# Vivado block design design_1, xczu28dr-ffvg1517-2-e, Vivado 2019.1
# (continued, part 3 of 5)
current_bd_instance /tx_channelizer
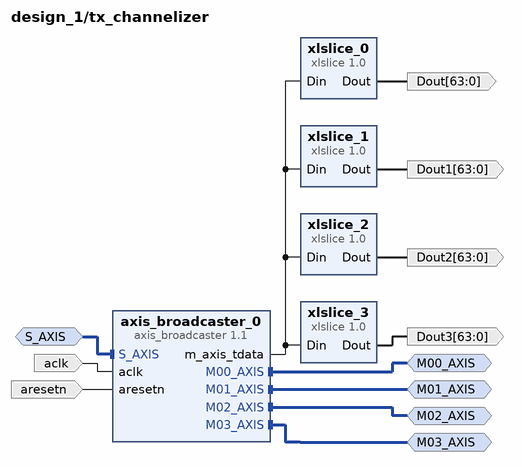
[diagram p43: block diagram inside /tx_channelizer]
create_bd_intf_pin -mode Slave -vlnv xilinx.com:interface:axis_rtl:1.0 S_AXIS
create_bd_intf_pin -mode Master -vlnv xilinx.com:interface:axis_rtl:1.0 M00_AXIS
create_bd_intf_pin -mode Master -vlnv xilinx.com:interface:axis_rtl:1.0 M01_AXIS
create_bd_intf_pin -mode Master -vlnv xilinx.com:interface:axis_rtl:1.0 M02_AXIS
create_bd_intf_pin -mode Master -vlnv xilinx.com:interface:axis_rtl:1.0 M03_AXIS
create_bd_pin -dir O -from 63 -to 0 Dout
create_bd_pin -dir O -from 63 -to 0 Dout1
create_bd_pin -dir O -from 63 -to 0 Dout2
create_bd_pin -dir O -from 63 -to 0 Dout3
create_bd_pin -dir I -type clk aclk
create_bd_pin -dir I -type rst aresetn

create_bd_cell -type ip -vlnv xilinx.com:ip:xlslice:1.0 xlslice_0
set_property -dict {CONFIG.DIN_FROM 255 CONFIG.DIN_TO 192 CONFIG.DIN_WIDTH 256 CONFIG.DOUT_WIDTH 1} [get_bd_cells xlslice_0]
create_bd_cell -type ip -vlnv xilinx.com:ip:xlslice:1.0 xlslice_1
set_property -dict {CONFIG.DIN_FROM 191 CONFIG.DIN_TO 128 CONFIG.DIN_WIDTH 256 CONFIG.DOUT_WIDTH 64} [get_bd_cells xlslice_1]
create_bd_cell -type ip -vlnv xilinx.com:ip:xlslice:1.0 xlslice_2
set_property -dict {CONFIG.DIN_FROM 63 CONFIG.DIN_TO 0 CONFIG.DIN_WIDTH 256 CONFIG.DOUT_WIDTH 1} [get_bd_cells xlslice_2]
create_bd_cell -type ip -vlnv xilinx.com:ip:xlslice:1.0 xlslice_3
set_property -dict {CONFIG.DIN_FROM 127 CONFIG.DIN_TO 64 CONFIG.DIN_WIDTH 256 CONFIG.DOUT_WIDTH 64} [get_bd_cells xlslice_3]
create_bd_cell -type ip -vlnv xilinx.com:ip:axis_broadcaster:1.1 axis_broadcaster_0
set_property -dict [list \
  CONFIG.HAS_TKEEP 1 \
  CONFIG.M02_TDATA_REMAP {tdata[255:0]} \
  CONFIG.M03_TDATA_REMAP {tdata[255:0]} \
  CONFIG.NUM_MI 4 \
] [get_bd_cells axis_broadcaster_0]

# ---- hierarchy /channel_mux ----
current_bd_instance /channel_mux
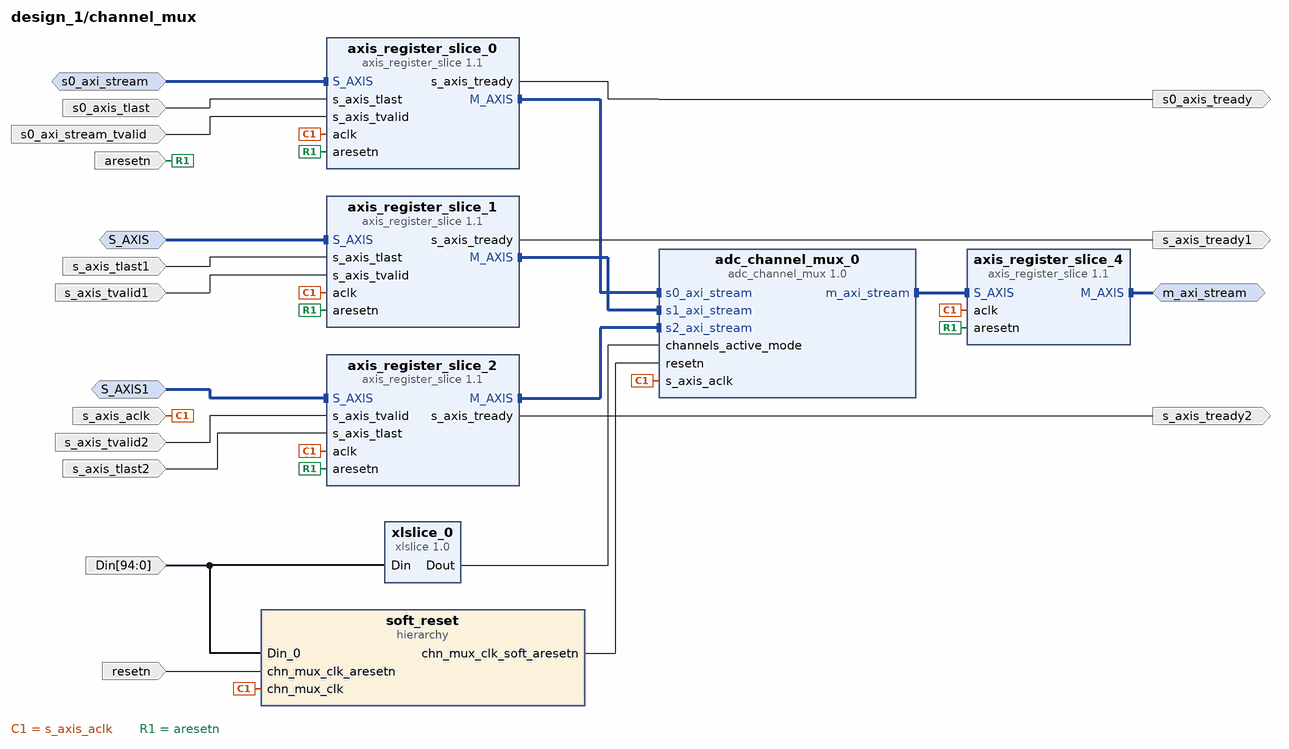
[diagram p44: block diagram inside /channel_mux]
create_bd_intf_pin -mode Master -vlnv xilinx.com:interface:axis_rtl:1.0 m_axi_stream
create_bd_intf_pin -mode Slave -vlnv xilinx.com:interface:axis_rtl:1.0 s0_axi_stream
create_bd_intf_pin -mode Slave -vlnv xilinx.com:interface:axis_rtl:1.0 S_AXIS
create_bd_intf_pin -mode Slave -vlnv xilinx.com:interface:axis_rtl:1.0 S_AXIS1
create_bd_pin -dir I -type clk s_axis_aclk
create_bd_pin -dir I -type rst resetn
create_bd_pin -dir I -from 94 -to 0 Din
create_bd_pin -dir O s0_axis_tready
create_bd_pin -dir I -type rst aresetn
create_bd_pin -dir I s0_axis_tlast
create_bd_pin -dir I s0_axi_stream_tvalid
create_bd_pin -dir I s_axis_tlast1
create_bd_pin -dir I s_axis_tvalid1
create_bd_pin -dir O s_axis_tready1
create_bd_pin -dir I s_axis_tvalid2
create_bd_pin -dir O s_axis_tready2
create_bd_pin -dir I s_axis_tlast2

create_bd_cell -type ip -vlnv user.org:user:adc_channel_mux:1.0 adc_channel_mux_0
set_property -dict {CONFIG.AXIS_TDATA_WIDTH 512} [get_bd_cells adc_channel_mux_0]
create_bd_cell -type ip -vlnv xilinx.com:ip:xlslice:1.0 xlslice_0
set_property -dict {CONFIG.DIN_FROM 73 CONFIG.DIN_TO 42 CONFIG.DIN_WIDTH 95 CONFIG.DOUT_WIDTH 32} [get_bd_cells xlslice_0]
create_bd_cell -type hier soft_reset
create_bd_cell -type ip -vlnv xilinx.com:ip:axis_register_slice:1.1 axis_register_slice_4
create_bd_cell -type ip -vlnv xilinx.com:ip:axis_register_slice:1.1 axis_register_slice_2
create_bd_cell -type ip -vlnv xilinx.com:ip:axis_register_slice:1.1 axis_register_slice_0
create_bd_cell -type ip -vlnv xilinx.com:ip:axis_register_slice:1.1 axis_register_slice_1

# ---- hierarchy /channel_mux/soft_reset ----
current_bd_instance /channel_mux/soft_reset
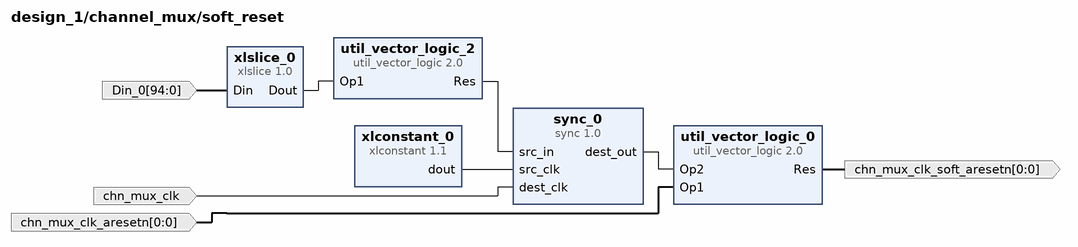
[diagram p45: block diagram inside /channel_mux/soft_reset]
create_bd_pin -dir I -from 94 -to 0 Din_0
create_bd_pin -dir I -type clk chn_mux_clk
create_bd_pin -dir O -from 0 -to 0 chn_mux_clk_soft_aresetn
create_bd_pin -dir I -from 0 -to 0 chn_mux_clk_aresetn

create_bd_cell -type ip -vlnv xilinx.com:ip:xlslice:1.0 xlslice_0
set_property -dict {CONFIG.DIN_FROM 74 CONFIG.DIN_TO 74 CONFIG.DIN_WIDTH 95 CONFIG.DOUT_WIDTH 1} [get_bd_cells xlslice_0]
create_bd_cell -type ip -vlnv xilinx.com:user:sync:1.0 sync_0
set_property -dict {CONFIG.SRC_INPUT_REG 0} [get_bd_cells sync_0]
create_bd_cell -type ip -vlnv xilinx.com:ip:xlconstant:1.1 xlconstant_0
set_property -dict {CONFIG.CONST_VAL 0} [get_bd_cells xlconstant_0]
create_bd_cell -type ip -vlnv xilinx.com:ip:util_vector_logic:2.0 util_vector_logic_2
set_property -dict {CONFIG.C_OPERATION not CONFIG.C_SIZE 1} [get_bd_cells util_vector_logic_2]
create_bd_cell -type ip -vlnv xilinx.com:ip:util_vector_logic:2.0 util_vector_logic_0
set_property -dict {CONFIG.C_SIZE 1} [get_bd_cells util_vector_logic_0]

# ---- connections ----

current_bd_instance /MTS_Block
connect_bd_intf_net [get_bd_intf_pins CLK_DIFF_PL_CLK] [get_bd_intf_pins util_ds_buf_0/CLK_IN_D]
connect_bd_intf_net [get_bd_intf_pins CLK_DIFF_SYSREF_CLK] [get_bd_intf_pins util_ds_buf_1/CLK_IN_D]
connect_bd_net [get_bd_pins util_ds_buf_0/IBUF_OUT] [get_bd_pins clk_wiz_0/clk_in1] [get_bd_pins sync_0/dest_clk]
connect_bd_net [get_bd_pins sync_0/dest_out] [get_bd_pins sync_1/src_in] [get_bd_pins sync_2/src_in]
connect_bd_net [get_bd_pins sync_1/dest_out] [get_bd_pins user_sysref_dac]
connect_bd_net [get_bd_pins xlconstant_0/dout] [get_bd_pins sync_0/src_clk] [get_bd_pins sync_1/src_clk] [get_bd_pins sync_2/src_clk]
connect_bd_net [get_bd_pins util_ds_buf_1/IBUF_OUT] [get_bd_pins sync_0/src_in]
connect_bd_net [get_bd_pins sync_2/dest_out] [get_bd_pins user_sysref_adc]
connect_bd_net [get_bd_pins clk_wiz_0/clk_out3] [get_bd_pins adc45_clk] [get_bd_pins sync_2/dest_clk]
connect_bd_net [get_bd_pins clk_wiz_0/clk_out1] [get_bd_pins dac45_clk] [get_bd_pins sync_1/dest_clk]
connect_bd_net [get_bd_pins clk_wiz_0/clk_out2] [get_bd_pins dac_clk]
connect_bd_net [get_bd_pins clk_wiz_0/clk_out4] [get_bd_pins adc_clk]

current_bd_instance /reset_block
connect_bd_net -net zynq_ultra_ps_e_0_pl_clk0 [get_bd_pins slowest_sync_clk] [get_bd_pins rst_ps8_0_96M/slowest_sync_clk]
connect_bd_net -net zynq_ultra_ps_e_0_pl_resetn0 [get_bd_pins ext_reset_in] \
  [get_bd_pins rst_ps8_0_96M1/ext_reset_in] [get_bd_pins rst_ps8_0_96M/ext_reset_in] \
  [get_bd_pins rst_ps8_0_96M2/ext_reset_in]
connect_bd_net [get_bd_pins rst_ps8_0_96M/peripheral_aresetn] [get_bd_pins peripheral_aresetn]
connect_bd_net -net MTS_Block_dac_clk [get_bd_pins slowest_sync_clk1] [get_bd_pins rst_ps8_0_96M1/slowest_sync_clk]
connect_bd_net [get_bd_pins rst_ps8_0_96M1/peripheral_aresetn] [get_bd_pins peripheral_aresetn1]
connect_bd_net [get_bd_pins rst_ddr4_0_333M/peripheral_aresetn] [get_bd_pins peripheral_aresetn2]
connect_bd_net -net slowest_sync_clk2_1 [get_bd_pins slowest_sync_clk2] [get_bd_pins rst_ddr4_0_333M/slowest_sync_clk]
connect_bd_net -net ext_reset_in1_1 [get_bd_pins ext_reset_in1] [get_bd_pins rst_ddr4_0_333M/ext_reset_in]
connect_bd_net [get_bd_pins rst_ps8_0_96M2/peripheral_aresetn] [get_bd_pins peripheral_aresetn3]
connect_bd_net -net slowest_sync_clk3_1 [get_bd_pins slowest_sync_clk3] [get_bd_pins rst_ps8_0_96M2/slowest_sync_clk]

current_bd_instance /dac_dma_block
connect_bd_intf_net [get_bd_intf_pins M00_AXIS] [get_bd_intf_pins axis_broadcaster_0/M00_AXIS]
connect_bd_intf_net [get_bd_intf_pins M01_AXIS] [get_bd_intf_pins axis_broadcaster_0/M01_AXIS]
connect_bd_intf_net [get_bd_intf_pins axi_register_slice_0/S_AXI] [get_bd_intf_pins axi_dma_0/M_AXI_MM2S]
connect_bd_intf_net [get_bd_intf_pins M04_AXIS] [get_bd_intf_pins axis_broadcaster_0/M04_AXIS]
connect_bd_intf_net [get_bd_intf_pins axis_register_slice_0/S_AXIS] [get_bd_intf_pins axi_dma_0/M_AXIS_MM2S]
connect_bd_intf_net [get_bd_intf_pins S_AXI_LITE] [get_bd_intf_pins axi_dma_0/S_AXI_LITE]
connect_bd_intf_net [get_bd_intf_pins M_AXI_MM2S] [get_bd_intf_pins axi_register_slice_0/M_AXI]
connect_bd_intf_net [get_bd_intf_pins M03_AXIS] [get_bd_intf_pins axis_broadcaster_0/M03_AXIS]
connect_bd_intf_net [get_bd_intf_pins axis_register_slice_0/M_AXIS] [get_bd_intf_pins axis_broadcaster_0/S_AXIS]
connect_bd_intf_net [get_bd_intf_pins M02_AXIS] [get_bd_intf_pins axis_broadcaster_0/M02_AXIS]
connect_bd_net -net zynq_ultra_ps_e_0_pl_clk0 [get_bd_pins s_axi_lite_aclk] [get_bd_pins axi_dma_0/s_axi_lite_aclk]
connect_bd_net -net rst_ps8_0_96M_peripheral_aresetn [get_bd_pins axi_resetn] [get_bd_pins axi_dma_0/axi_resetn]
connect_bd_net -net ddr4_0_c0_ddr4_ui_clk [get_bd_pins m_axi_mm2s_aclk] \
  [get_bd_pins axi_dma_0/m_axi_mm2s_aclk] [get_bd_pins axis_broadcaster_0/aclk] [get_bd_pins axi_register_slice_0/aclk] \
  [get_bd_pins axis_register_slice_0/aclk]
connect_bd_net [get_bd_pins aresetn_300Mhz] \
  [get_bd_pins axis_broadcaster_0/aresetn] [get_bd_pins axis_register_slice_0/aresetn] \
  [get_bd_pins axi_register_slice_0/aresetn]

current_bd_instance /ddr_block
connect_bd_intf_net [get_bd_intf_pins axi_register_slice_0/M_AXI] [get_bd_intf_pins ddr4_0/C0_DDR4_S_AXI]
connect_bd_intf_net [get_bd_intf_pins smartconnect_0/M00_AXI] [get_bd_intf_pins axi_register_slice_0/S_AXI]
connect_bd_intf_net [get_bd_intf_pins S_AXI] [get_bd_intf_pins axi_register_slice_3/S_AXI]
connect_bd_intf_net [get_bd_intf_pins axi_register_slice_3/M_AXI] [get_bd_intf_pins smartconnect_0/S02_AXI]
connect_bd_intf_net [get_bd_intf_pins axi_register_slice_1/M_AXI] [get_bd_intf_pins smartconnect_0/S00_AXI]
connect_bd_intf_net [get_bd_intf_pins ddr4_sdram] [get_bd_intf_pins ddr4_0/C0_DDR4]
connect_bd_intf_net [get_bd_intf_pins HPM0_AXI] [get_bd_intf_pins axi_register_slice_2/S_AXI]
connect_bd_intf_net [get_bd_intf_pins axi_register_slice_2/M_AXI] [get_bd_intf_pins smartconnect_0/S01_AXI]
connect_bd_intf_net [get_bd_intf_pins user_si570_sysclk] [get_bd_intf_pins ddr4_0/C0_SYS_CLK]
connect_bd_intf_net [get_bd_intf_pins S00_AXI] [get_bd_intf_pins axi_register_slice_1/S_AXI]
connect_bd_net [get_bd_pins ddr4_0/c0_ddr4_ui_clk] \
  [get_bd_pins c0_ddr4_ui_clk] [get_bd_pins smartconnect_0/aclk] [get_bd_pins axi_register_slice_0/aclk] \
  [get_bd_pins axi_register_slice_1/aclk] [get_bd_pins axi_register_slice_2/aclk] [get_bd_pins axi_register_slice_3/aclk]
connect_bd_net -net rst_ddr4_0_333M_peripheral_aresetn [get_bd_pins ARESETN] \
  [get_bd_pins ddr4_0/c0_ddr4_aresetn] [get_bd_pins smartconnect_0/aresetn] [get_bd_pins axi_register_slice_0/aresetn] \
  [get_bd_pins axi_register_slice_1/aresetn] [get_bd_pins axi_register_slice_2/aresetn] \
  [get_bd_pins axi_register_slice_3/aresetn]
connect_bd_net [get_bd_pins ddr4_0/c0_ddr4_ui_clk_sync_rst] [get_bd_pins c0_ddr4_ui_clk_sync_rst]
connect_bd_net [get_bd_pins reset] [get_bd_pins ddr4_0/sys_rst]

current_bd_instance /control_block
connect_bd_net -net Din_0_1 [get_bd_pins Din_0] [get_bd_pins globalstart_gpio_dac/Din] [get_bd_pins globalstart_gpio_adc/Din]
connect_bd_net -net xlslice_0_Dout [get_bd_pins globalstart_gpio_dac/Dout] [get_bd_pins sync_0/src_in]
connect_bd_net [get_bd_pins xlconstant_0/dout] [get_bd_pins sync_0/src_clk] [get_bd_pins sync_1/src_clk]
connect_bd_net -net dest_clk_0_1 [get_bd_pins dac_clk] [get_bd_pins sync_0/dest_clk]
connect_bd_net [get_bd_pins sync_0/dest_out] [get_bd_pins dac_control]
connect_bd_net [get_bd_pins sync_1/dest_out] [get_bd_pins adc_control]
connect_bd_net -net dest_clk_1 [get_bd_pins adc_clk] [get_bd_pins sync_1/dest_clk]
connect_bd_net [get_bd_pins globalstart_gpio_adc/Dout] [get_bd_pins sync_1/src_in]

current_bd_instance /adc_tile2
connect_bd_intf_net [get_bd_intf_pins SLOT_0_AXIS] [get_bd_intf_pins axis_combiner_0/M_AXIS]
connect_bd_intf_net [get_bd_intf_pins axis_register_slice_1/M_AXIS] [get_bd_intf_pins axis_data_fifo_1/S_AXIS]
connect_bd_intf_net [get_bd_intf_pins axis_register_slice_1/S_AXIS] [get_bd_intf_pins axis_dwidth_converter_1/M_AXIS]
connect_bd_intf_net [get_bd_intf_pins axis_register_slice_0/M_AXIS] [get_bd_intf_pins axis_data_fifo_0/S_AXIS]
connect_bd_intf_net [get_bd_intf_pins packet_counter_0/M01_AXIS] [get_bd_intf_pins axis_dwidth_converter_1/S_AXIS]
connect_bd_intf_net [get_bd_intf_pins axis_data_fifo_1/M_AXIS] [get_bd_intf_pins axis_combiner_0/S01_AXIS]
connect_bd_intf_net [get_bd_intf_pins s00_axi] [get_bd_intf_pins tlast_gen_v1_0_0/s00_axi]
connect_bd_intf_net [get_bd_intf_pins axis_dwidth_converter_0/M_AXIS] [get_bd_intf_pins axis_register_slice_0/S_AXIS]
connect_bd_intf_net [get_bd_intf_pins axis_data_fifo_0/M_AXIS] [get_bd_intf_pins axis_combiner_0/S00_AXIS]
connect_bd_intf_net [get_bd_intf_pins packet_counter_0/M00_AXIS] [get_bd_intf_pins axis_dwidth_converter_0/S_AXIS]
connect_bd_intf_net [get_bd_intf_pins S00_AXIS] [get_bd_intf_pins packet_counter_0/S00_AXIS]
connect_bd_intf_net [get_bd_intf_pins S00_AXI1] [get_bd_intf_pins packet_counter_0/S00_AXI]
connect_bd_intf_net [get_bd_intf_pins S01_AXIS] [get_bd_intf_pins packet_counter_0/S01_AXIS]
connect_bd_net -net ddr4_0_c0_ddr4_ui_clk [get_bd_pins s_axis_aclk] \
  [get_bd_pins soft_reset/s_axis_aclk_300] [get_bd_pins axis_data_fifo_0/m_axis_aclk] \
  [get_bd_pins axis_data_fifo_1/m_axis_aclk] [get_bd_pins axis_combiner_0/aclk] [get_bd_pins tlast_gen_v1_0_0/axis_clk]
connect_bd_net -net MTS_Block_dac_clk [get_bd_pins adc_clk] \
  [get_bd_pins soft_reset/adc_clk] [get_bd_pins axis_data_fifo_0/s_axis_aclk] [get_bd_pins axis_dwidth_converter_1/aclk] \
  [get_bd_pins axis_dwidth_converter_0/aclk] [get_bd_pins axis_data_fifo_1/s_axis_aclk] \
  [get_bd_pins axis_register_slice_0/aclk] [get_bd_pins axis_register_slice_1/aclk] [get_bd_pins packet_counter_0/aclk]
connect_bd_net -net Din_0_1 [get_bd_pins Din_0] [get_bd_pins soft_reset/Din_0]
connect_bd_net [get_bd_pins axi_resetn] [get_bd_pins soft_reset/axi_resetn]
connect_bd_net [get_bd_pins adc_clk_aresetn] [get_bd_pins soft_reset/adc_clk_aresetn]
connect_bd_net [get_bd_pins soft_reset/dac_clk_soft_aresetn] \
  [get_bd_pins axis_data_fifo_0/s_axis_aresetn] [get_bd_pins axis_dwidth_converter_1/aresetn] \
  [get_bd_pins axis_dwidth_converter_0/aresetn] [get_bd_pins axis_data_fifo_1/s_axis_aresetn] \
  [get_bd_pins axis_register_slice_0/aresetn] [get_bd_pins axis_register_slice_1/aresetn] \
  [get_bd_pins packet_counter_0/aresetn]
connect_bd_net -net dac_control_1 [get_bd_pins adc_control] [get_bd_pins control_switch1/dac_control] [get_bd_pins control_switch0/dac_control]
connect_bd_net [get_bd_pins soft_reset/axi_soft_resetn] [get_bd_pins axis_combiner_0/aresetn] [get_bd_pins tlast_gen_v1_0_0/rstn]
connect_bd_net [get_bd_pins axis_combiner_0/m_axis_tvalid] [get_bd_pins m_axis_tvalid] [get_bd_pins tlast_gen_v1_0_0/tvalid]
connect_bd_net [get_bd_pins m_axis_tready] [get_bd_pins axis_combiner_0/m_axis_tready] [get_bd_pins tlast_gen_v1_0_0/trdy]
connect_bd_net -net control_switch1_tready_o [get_bd_pins control_switch0/tready_o] [get_bd_pins tready_o]
connect_bd_net [get_bd_pins tvalid_i] [get_bd_pins control_switch0/tvalid_i]
connect_bd_net -net control_switch0_tready_o [get_bd_pins control_switch1/tready_o] [get_bd_pins tready_o1]
connect_bd_net [get_bd_pins tvalid_i1] [get_bd_pins control_switch1/tvalid_i]
connect_bd_net [get_bd_pins axis_data_fifo_0/axis_wr_data_count] [get_bd_pins axis_wr_data_count]
connect_bd_net [get_bd_pins axis_data_fifo_1/axis_wr_data_count] [get_bd_pins axis_wr_data_count1]
connect_bd_net [get_bd_pins s00_axi_aclk] [get_bd_pins tlast_gen_v1_0_0/s00_axi_aclk] [get_bd_pins packet_counter_0/s00_axi_aclk]
connect_bd_net [get_bd_pins s00_axi_aresetn] [get_bd_pins tlast_gen_v1_0_0/s00_axi_aresetn] [get_bd_pins packet_counter_0/s00_axi_aresetn]
connect_bd_net [get_bd_pins tlast_gen_v1_0_0/tlast] [get_bd_pins tlast]
connect_bd_net [get_bd_pins PD_FLAG] [get_bd_pins packet_counter_0/PD_FLAG]
connect_bd_net -net tready_i_1 [get_bd_pins packet_counter_0/s00_axis_tready] [get_bd_pins control_switch0/tready_i]
connect_bd_net [get_bd_pins control_switch0/tvalid_o] [get_bd_pins packet_counter_0/s00_axis_tvalid]
connect_bd_net [get_bd_pins control_switch1/tvalid_o] [get_bd_pins packet_counter_0/s01_axis_tvalid]
connect_bd_net -net tready_i_2 [get_bd_pins packet_counter_0/s01_axis_tready] [get_bd_pins control_switch1/tready_i]

current_bd_instance /adc_tile2/soft_reset
connect_bd_net [get_bd_pins xlslice_0/Dout] [get_bd_pins util_vector_logic_2/Op1]
connect_bd_net [get_bd_pins util_vector_logic_2/Res] [get_bd_pins sync_1/src_in] [get_bd_pins sync_0/src_in]
connect_bd_net [get_bd_pins xlconstant_0/dout] [get_bd_pins sync_1/src_clk] [get_bd_pins sync_0/src_clk]
connect_bd_net -net Din_1_1 [get_bd_pins Din_0] [get_bd_pins xlslice_0/Din]
connect_bd_net -net dest_clk_0_1 [get_bd_pins adc_clk] [get_bd_pins sync_0/dest_clk]
connect_bd_net -net dest_clk_1_1 [get_bd_pins s_axis_aclk_300] [get_bd_pins sync_1/dest_clk]
connect_bd_net [get_bd_pins sync_0/dest_out] [get_bd_pins util_vector_logic_0/Op2]
connect_bd_net -net dac_clk_aresetn_1 [get_bd_pins adc_clk_aresetn] [get_bd_pins util_vector_logic_0/Op1]
connect_bd_net [get_bd_pins util_vector_logic_0/Res] [get_bd_pins dac_clk_soft_aresetn]
connect_bd_net [get_bd_pins axi_resetn] [get_bd_pins util_vector_logic_1/Op2]
connect_bd_net [get_bd_pins sync_1/dest_out] [get_bd_pins util_vector_logic_1/Op1]
connect_bd_net [get_bd_pins util_vector_logic_1/Res] [get_bd_pins axi_soft_resetn]

current_bd_instance /adc_tile2/control_switch1
connect_bd_net -net Op1_0_1 [get_bd_pins tready_i] [get_bd_pins util_vector_logic_0/Op1]
connect_bd_net -net Op1_1_1 [get_bd_pins tvalid_i] [get_bd_pins util_vector_logic_1/Op1]
connect_bd_net [get_bd_pins util_vector_logic_0/Res] [get_bd_pins tready_o]
connect_bd_net [get_bd_pins util_vector_logic_1/Res] [get_bd_pins tvalid_o]
connect_bd_net -net util_vector_logic_2_Res [get_bd_pins dac_control] [get_bd_pins util_vector_logic_0/Op2] [get_bd_pins util_vector_logic_1/Op2]

current_bd_instance /adc_tile2/control_switch0
connect_bd_net -net Op1_0_1 [get_bd_pins tready_i] [get_bd_pins util_vector_logic_0/Op1]
connect_bd_net -net Op1_1_1 [get_bd_pins tvalid_i] [get_bd_pins util_vector_logic_1/Op1]
connect_bd_net [get_bd_pins util_vector_logic_0/Res] [get_bd_pins tready_o]
connect_bd_net [get_bd_pins util_vector_logic_1/Res] [get_bd_pins tvalid_o]
connect_bd_net -net util_vector_logic_2_Res [get_bd_pins dac_control] [get_bd_pins util_vector_logic_0/Op2] [get_bd_pins util_vector_logic_1/Op2]

current_bd_instance /adc_tile3
connect_bd_intf_net [get_bd_intf_pins axis_dwidth_converter_0/M_AXIS] [get_bd_intf_pins axis_register_slice_0/S_AXIS]
connect_bd_intf_net [get_bd_intf_pins axis_register_slice_0/M_AXIS] [get_bd_intf_pins axis_data_fifo_0/S_AXIS]
connect_bd_intf_net [get_bd_intf_pins S00_AXIS] [get_bd_intf_pins packet_counter_0/S00_AXIS]
connect_bd_intf_net [get_bd_intf_pins axis_data_fifo_0/M_AXIS] [get_bd_intf_pins axis_combiner_0/S00_AXIS]
connect_bd_intf_net [get_bd_intf_pins axis_register_slice_1/S_AXIS] [get_bd_intf_pins axis_dwidth_converter_1/M_AXIS]
connect_bd_intf_net [get_bd_intf_pins packet_counter_0/M01_AXIS] [get_bd_intf_pins axis_dwidth_converter_1/S_AXIS]
connect_bd_intf_net [get_bd_intf_pins S00_AXI2] [get_bd_intf_pins packet_counter_0/S00_AXI]
connect_bd_intf_net [get_bd_intf_pins packet_counter_0/M00_AXIS] [get_bd_intf_pins axis_dwidth_converter_0/S_AXIS]
connect_bd_intf_net [get_bd_intf_pins s00_axi1] [get_bd_intf_pins tlast_gen_v1_0_0/s00_axi]
connect_bd_intf_net [get_bd_intf_pins S01_AXIS] [get_bd_intf_pins packet_counter_0/S01_AXIS]
connect_bd_intf_net [get_bd_intf_pins axis_register_slice_1/M_AXIS] [get_bd_intf_pins axis_data_fifo_1/S_AXIS]
connect_bd_intf_net [get_bd_intf_pins SLOT_0_AXIS] [get_bd_intf_pins axis_combiner_0/M_AXIS]
connect_bd_intf_net [get_bd_intf_pins axis_data_fifo_1/M_AXIS] [get_bd_intf_pins axis_combiner_0/S01_AXIS]
connect_bd_net -net MTS_Block_dac_clk [get_bd_pins adc_clk] \
  [get_bd_pins soft_reset/adc_clk] [get_bd_pins axis_data_fifo_0/s_axis_aclk] [get_bd_pins axis_dwidth_converter_1/aclk] \
  [get_bd_pins axis_dwidth_converter_0/aclk] [get_bd_pins axis_data_fifo_1/s_axis_aclk] \
  [get_bd_pins axis_register_slice_0/aclk] [get_bd_pins axis_register_slice_1/aclk] [get_bd_pins packet_counter_0/aclk]
connect_bd_net -net Din_0_1 [get_bd_pins Din_0] [get_bd_pins soft_reset/Din_0]
connect_bd_net [get_bd_pins axi_resetn] [get_bd_pins soft_reset/axi_resetn]
connect_bd_net [get_bd_pins adc_clk_aresetn] [get_bd_pins soft_reset/adc_clk_aresetn]
connect_bd_net [get_bd_pins soft_reset/dac_clk_soft_aresetn] \
  [get_bd_pins axis_data_fifo_0/s_axis_aresetn] [get_bd_pins axis_dwidth_converter_1/aresetn] \
  [get_bd_pins axis_dwidth_converter_0/aresetn] [get_bd_pins axis_data_fifo_1/s_axis_aresetn] \
  [get_bd_pins axis_register_slice_0/aresetn] [get_bd_pins axis_register_slice_1/aresetn] \
  [get_bd_pins packet_counter_0/aresetn]
connect_bd_net -net dac_control_1 [get_bd_pins adc_control] [get_bd_pins control_switch1/dac_control] [get_bd_pins control_switch0/dac_control]
connect_bd_net [get_bd_pins soft_reset/axi_soft_resetn] [get_bd_pins axis_combiner_0/aresetn] [get_bd_pins tlast_gen_v1_0_0/rstn]
connect_bd_net [get_bd_pins axis_combiner_0/m_axis_tvalid] [get_bd_pins m_axis_tvalid] [get_bd_pins tlast_gen_v1_0_0/tvalid]
connect_bd_net [get_bd_pins m_axis_tready] [get_bd_pins axis_combiner_0/m_axis_tready] [get_bd_pins tlast_gen_v1_0_0/trdy]
connect_bd_net -net ddr4_0_c0_ddr4_ui_clk [get_bd_pins s_axis_aclk] \
  [get_bd_pins soft_reset/s_axis_aclk_300] [get_bd_pins axis_data_fifo_0/m_axis_aclk] \
  [get_bd_pins axis_data_fifo_1/m_axis_aclk] [get_bd_pins axis_combiner_0/aclk] [get_bd_pins tlast_gen_v1_0_0/axis_clk]
connect_bd_net -net control_switch2_tready_o [get_bd_pins control_switch0/tready_o] [get_bd_pins tready_o]
connect_bd_net [get_bd_pins tvalid_i] [get_bd_pins control_switch0/tvalid_i]
connect_bd_net -net control_switch3_tready_o [get_bd_pins control_switch1/tready_o] [get_bd_pins tready_o1]
connect_bd_net [get_bd_pins tvalid_i1] [get_bd_pins control_switch1/tvalid_i]
connect_bd_net [get_bd_pins axis_data_fifo_0/axis_wr_data_count] [get_bd_pins axis_wr_data_count]
connect_bd_net [get_bd_pins axis_data_fifo_1/axis_wr_data_count] [get_bd_pins axis_wr_data_count1]
connect_bd_net [get_bd_pins s00_axi_aclk] [get_bd_pins tlast_gen_v1_0_0/s00_axi_aclk] [get_bd_pins packet_counter_0/s00_axi_aclk]
connect_bd_net [get_bd_pins s00_axi_aresetn] [get_bd_pins tlast_gen_v1_0_0/s00_axi_aresetn] [get_bd_pins packet_counter_0/s00_axi_aresetn]
connect_bd_net [get_bd_pins tlast_gen_v1_0_0/tlast] [get_bd_pins tlast]
connect_bd_net [get_bd_pins PD_FLAG] [get_bd_pins packet_counter_0/PD_FLAG]
connect_bd_net [get_bd_pins control_switch0/tvalid_o] [get_bd_pins packet_counter_0/s00_axis_tvalid]
connect_bd_net -net tready_i_1 [get_bd_pins packet_counter_0/s00_axis_tready] [get_bd_pins control_switch0/tready_i]
connect_bd_net [get_bd_pins control_switch1/tvalid_o] [get_bd_pins packet_counter_0/s01_axis_tvalid]
connect_bd_net -net tready_i_2 [get_bd_pins packet_counter_0/s01_axis_tready] [get_bd_pins control_switch1/tready_i]

current_bd_instance /adc_tile3/soft_reset
connect_bd_net [get_bd_pins xlslice_0/Dout] [get_bd_pins util_vector_logic_2/Op1]
connect_bd_net [get_bd_pins util_vector_logic_2/Res] [get_bd_pins sync_1/src_in] [get_bd_pins sync_0/src_in]
connect_bd_net [get_bd_pins xlconstant_0/dout] [get_bd_pins sync_1/src_clk] [get_bd_pins sync_0/src_clk]
connect_bd_net -net Din_1_1 [get_bd_pins Din_0] [get_bd_pins xlslice_0/Din]
connect_bd_net -net dest_clk_0_1 [get_bd_pins adc_clk] [get_bd_pins sync_0/dest_clk]
connect_bd_net -net dest_clk_1_1 [get_bd_pins s_axis_aclk_300] [get_bd_pins sync_1/dest_clk]
connect_bd_net [get_bd_pins sync_0/dest_out] [get_bd_pins util_vector_logic_0/Op2]
connect_bd_net -net dac_clk_aresetn_1 [get_bd_pins adc_clk_aresetn] [get_bd_pins util_vector_logic_0/Op1]
connect_bd_net [get_bd_pins axi_resetn] [get_bd_pins util_vector_logic_1/Op2]
connect_bd_net [get_bd_pins sync_1/dest_out] [get_bd_pins util_vector_logic_1/Op1]
connect_bd_net [get_bd_pins util_vector_logic_0/Res] [get_bd_pins dac_clk_soft_aresetn]
connect_bd_net [get_bd_pins util_vector_logic_1/Res] [get_bd_pins axi_soft_resetn]

current_bd_instance /adc_tile3/control_switch0
connect_bd_net -net Op1_0_1 [get_bd_pins tready_i] [get_bd_pins util_vector_logic_0/Op1]
connect_bd_net -net Op1_1_1 [get_bd_pins tvalid_i] [get_bd_pins util_vector_logic_1/Op1]
connect_bd_net [get_bd_pins util_vector_logic_0/Res] [get_bd_pins tready_o]
connect_bd_net [get_bd_pins util_vector_logic_1/Res] [get_bd_pins tvalid_o]
connect_bd_net -net util_vector_logic_2_Res [get_bd_pins dac_control] [get_bd_pins util_vector_logic_0/Op2] [get_bd_pins util_vector_logic_1/Op2]

current_bd_instance /adc_tile3/control_switch1
connect_bd_net -net Op1_0_1 [get_bd_pins tready_i] [get_bd_pins util_vector_logic_0/Op1]
connect_bd_net -net Op1_1_1 [get_bd_pins tvalid_i] [get_bd_pins util_vector_logic_1/Op1]
connect_bd_net [get_bd_pins util_vector_logic_0/Res] [get_bd_pins tready_o]
connect_bd_net [get_bd_pins util_vector_logic_1/Res] [get_bd_pins tvalid_o]
connect_bd_net -net util_vector_logic_2_Res [get_bd_pins dac_control] [get_bd_pins util_vector_logic_0/Op2] [get_bd_pins util_vector_logic_1/Op2]

current_bd_instance /adc_tile0
connect_bd_intf_net [get_bd_intf_pins S00_AXIS] [get_bd_intf_pins packet_counter_0/S00_AXIS]
connect_bd_intf_net [get_bd_intf_pins S01_AXIS] [get_bd_intf_pins packet_counter_0/S01_AXIS]
connect_bd_intf_net [get_bd_intf_pins axis_register_slice_1/S_AXIS] [get_bd_intf_pins axis_dwidth_converter_1/M_AXIS]
connect_bd_intf_net [get_bd_intf_pins S00_AXI2] [get_bd_intf_pins packet_counter_0/S00_AXI]
connect_bd_intf_net [get_bd_intf_pins axis_register_slice_1/M_AXIS] [get_bd_intf_pins axis_data_fifo_0/S_AXIS]
connect_bd_intf_net [get_bd_intf_pins axis_data_fifo_1/M_AXIS] [get_bd_intf_pins axis_combiner_0/S01_AXIS]
connect_bd_intf_net [get_bd_intf_pins packet_counter_0/M01_AXIS] [get_bd_intf_pins axis_dwidth_converter_1/S_AXIS]
connect_bd_intf_net [get_bd_intf_pins packet_counter_0/M00_AXIS] [get_bd_intf_pins axis_dwidth_converter_0/S_AXIS]
connect_bd_intf_net [get_bd_intf_pins axis_dwidth_converter_0/M_AXIS] [get_bd_intf_pins axis_register_slice_0/S_AXIS]
connect_bd_intf_net [get_bd_intf_pins s00_axi1] [get_bd_intf_pins tlast_gen_v1_0_0/s00_axi]
connect_bd_intf_net [get_bd_intf_pins SLOT_0_AXIS] [get_bd_intf_pins axis_combiner_0/M_AXIS]
connect_bd_intf_net [get_bd_intf_pins axis_data_fifo_0/M_AXIS] [get_bd_intf_pins axis_combiner_0/S00_AXIS]
connect_bd_intf_net [get_bd_intf_pins axis_register_slice_0/M_AXIS] [get_bd_intf_pins axis_data_fifo_1/S_AXIS]
connect_bd_net -net MTS_Block_dac_clk [get_bd_pins adc_clk] \
  [get_bd_pins soft_reset/adc_clk] [get_bd_pins axis_data_fifo_0/s_axis_aclk] [get_bd_pins axis_dwidth_converter_1/aclk] \
  [get_bd_pins axis_dwidth_converter_0/aclk] [get_bd_pins axis_data_fifo_1/s_axis_aclk] \
  [get_bd_pins axis_register_slice_0/aclk] [get_bd_pins axis_register_slice_1/aclk] [get_bd_pins packet_counter_0/aclk]
connect_bd_net -net Din_0_1 [get_bd_pins Din_0] [get_bd_pins soft_reset/Din_0]
connect_bd_net [get_bd_pins axi_resetn] [get_bd_pins soft_reset/axi_resetn]
connect_bd_net [get_bd_pins adc_clk_aresetn] [get_bd_pins soft_reset/adc_clk_aresetn]
connect_bd_net [get_bd_pins soft_reset/dac_clk_soft_aresetn] \
  [get_bd_pins axis_data_fifo_0/s_axis_aresetn] [get_bd_pins axis_dwidth_converter_1/aresetn] \
  [get_bd_pins axis_dwidth_converter_0/aresetn] [get_bd_pins axis_data_fifo_1/s_axis_aresetn] \
  [get_bd_pins axis_register_slice_0/aresetn] [get_bd_pins axis_register_slice_1/aresetn] \
  [get_bd_pins packet_counter_0/aresetn]
connect_bd_net -net dac_control_1 [get_bd_pins adc_control] [get_bd_pins control_switch1/dac_control] [get_bd_pins control_switch0/dac_control]
connect_bd_net [get_bd_pins soft_reset/axi_soft_resetn] \
  [get_bd_pins axis_combiner_0/aresetn] [get_bd_pins tlast_gen_v1_0_0/rstn] [get_bd_pins axi_soft_resetn]
connect_bd_net [get_bd_pins axis_combiner_0/m_axis_tvalid] [get_bd_pins m_axis_tvalid] [get_bd_pins tlast_gen_v1_0_0/tvalid]
connect_bd_net [get_bd_pins m_axis_tready] [get_bd_pins axis_combiner_0/m_axis_tready] [get_bd_pins tlast_gen_v1_0_0/trdy]
connect_bd_net -net ddr4_0_c0_ddr4_ui_clk [get_bd_pins s_axis_aclk] \
  [get_bd_pins soft_reset/s_axis_aclk_300] [get_bd_pins axis_data_fifo_0/m_axis_aclk] \
  [get_bd_pins axis_data_fifo_1/m_axis_aclk] [get_bd_pins axis_combiner_0/aclk] [get_bd_pins tlast_gen_v1_0_0/axis_clk]
connect_bd_net -net control_switch2_tready_o [get_bd_pins control_switch0/tready_o] [get_bd_pins tready_o]
connect_bd_net [get_bd_pins tvalid_i] [get_bd_pins control_switch0/tvalid_i]
connect_bd_net -net control_switch3_tready_o [get_bd_pins control_switch1/tready_o] [get_bd_pins tready_o1]
connect_bd_net [get_bd_pins tvalid_i1] [get_bd_pins control_switch1/tvalid_i]
connect_bd_net [get_bd_pins axis_data_fifo_0/axis_wr_data_count] [get_bd_pins axis_wr_data_count]
connect_bd_net [get_bd_pins axis_data_fifo_1/axis_wr_data_count] [get_bd_pins axis_wr_data_count1]
connect_bd_net [get_bd_pins s00_axi_aclk] [get_bd_pins tlast_gen_v1_0_0/s00_axi_aclk] [get_bd_pins packet_counter_0/s00_axi_aclk]
connect_bd_net [get_bd_pins s00_axi_aresetn] [get_bd_pins tlast_gen_v1_0_0/s00_axi_aresetn] [get_bd_pins packet_counter_0/s00_axi_aresetn]
connect_bd_net [get_bd_pins tlast_gen_v1_0_0/tlast] [get_bd_pins tlast]
connect_bd_net -net PD_FLAG2_1 [get_bd_pins PD_FLAG2] [get_bd_pins packet_counter_0/PD_FLAG]
connect_bd_net [get_bd_pins control_switch0/tvalid_o] [get_bd_pins packet_counter_0/s00_axis_tvalid]
connect_bd_net -net tready_i_1 [get_bd_pins packet_counter_0/s00_axis_tready] [get_bd_pins control_switch0/tready_i]
connect_bd_net [get_bd_pins control_switch1/tvalid_o] [get_bd_pins packet_counter_0/s01_axis_tvalid]
connect_bd_net -net tready_i_2 [get_bd_pins packet_counter_0/s01_axis_tready] [get_bd_pins control_switch1/tready_i]

current_bd_instance /adc_tile0/soft_reset
connect_bd_net [get_bd_pins xlslice_0/Dout] [get_bd_pins util_vector_logic_2/Op1]
connect_bd_net [get_bd_pins util_vector_logic_2/Res] [get_bd_pins sync_1/src_in] [get_bd_pins sync_0/src_in]
connect_bd_net [get_bd_pins xlconstant_0/dout] [get_bd_pins sync_1/src_clk] [get_bd_pins sync_0/src_clk]
connect_bd_net -net Din_1_1 [get_bd_pins Din_0] [get_bd_pins xlslice_0/Din]
connect_bd_net -net dest_clk_0_1 [get_bd_pins adc_clk] [get_bd_pins sync_0/dest_clk]
connect_bd_net -net dest_clk_1_1 [get_bd_pins s_axis_aclk_300] [get_bd_pins sync_1/dest_clk]
connect_bd_net [get_bd_pins sync_0/dest_out] [get_bd_pins util_vector_logic_0/Op2]
connect_bd_net -net dac_clk_aresetn_1 [get_bd_pins adc_clk_aresetn] [get_bd_pins util_vector_logic_0/Op1]
connect_bd_net [get_bd_pins axi_resetn] [get_bd_pins util_vector_logic_1/Op2]
connect_bd_net [get_bd_pins sync_1/dest_out] [get_bd_pins util_vector_logic_1/Op1]
connect_bd_net [get_bd_pins util_vector_logic_0/Res] [get_bd_pins dac_clk_soft_aresetn]
connect_bd_net [get_bd_pins util_vector_logic_1/Res] [get_bd_pins axi_soft_resetn]

current_bd_instance /adc_tile0/control_switch0
connect_bd_net -net Op1_0_1 [get_bd_pins tready_i] [get_bd_pins util_vector_logic_0/Op1]
connect_bd_net -net Op1_1_1 [get_bd_pins tvalid_i] [get_bd_pins util_vector_logic_1/Op1]
connect_bd_net [get_bd_pins util_vector_logic_0/Res] [get_bd_pins tready_o]
connect_bd_net [get_bd_pins util_vector_logic_1/Res] [get_bd_pins tvalid_o]
connect_bd_net -net util_vector_logic_2_Res [get_bd_pins dac_control] [get_bd_pins util_vector_logic_0/Op2] [get_bd_pins util_vector_logic_1/Op2]

current_bd_instance /adc_tile0/control_switch1
connect_bd_net -net Op1_0_1 [get_bd_pins tready_i] [get_bd_pins util_vector_logic_0/Op1]
connect_bd_net -net Op1_1_1 [get_bd_pins tvalid_i] [get_bd_pins util_vector_logic_1/Op1]
connect_bd_net [get_bd_pins util_vector_logic_0/Res] [get_bd_pins tready_o]
connect_bd_net [get_bd_pins util_vector_logic_1/Res] [get_bd_pins tvalid_o]
connect_bd_net -net util_vector_logic_2_Res [get_bd_pins dac_control] [get_bd_pins util_vector_logic_0/Op2] [get_bd_pins util_vector_logic_1/Op2]

current_bd_instance /dac_block3_tile0
connect_bd_intf_net [get_bd_intf_pins axis_register_slice_0/M_AXIS] [get_bd_intf_pins axis_data_fifo_2/S_AXIS]
connect_bd_intf_net [get_bd_intf_pins axis_data_fifo_2/M_AXIS] [get_bd_intf_pins axis_broadcaster_0/S_AXIS]
connect_bd_intf_net [get_bd_intf_pins axis_data_fifo_1/S_AXIS] [get_bd_intf_pins axis_broadcaster_0/M01_AXIS]
connect_bd_intf_net [get_bd_intf_pins S00_AXI] [get_bd_intf_pins idle_packet_0/S00_AXI]
connect_bd_intf_net [get_bd_intf_pins axis_data_fifo_0/M_AXIS] [get_bd_intf_pins adc_strm_mux_0/s0_axi_stream]
connect_bd_intf_net [get_bd_intf_pins S_AXIS] [get_bd_intf_pins axis_data_fifo_0/S_AXIS]
connect_bd_intf_net [get_bd_intf_pins SLOT_0_AXIS] [get_bd_intf_pins idle_packet_0/M00_AXIS]
connect_bd_intf_net [get_bd_intf_pins axis_data_fifo_1/M_AXIS] [get_bd_intf_pins adc_strm_mux_0/s1_axi_stream]
connect_bd_intf_net [get_bd_intf_pins axis_broadcaster_0/M00_AXIS] [get_bd_intf_pins idle_packet_0/S00_AXIS]
connect_bd_intf_net [get_bd_intf_pins adc_strm_mux_0/m0_axi_stream] [get_bd_intf_pins axis_register_slice_0/S_AXIS]
connect_bd_net -net ddr4_0_c0_ddr4_ui_clk [get_bd_pins s_axis_aclk] \
  [get_bd_pins axis_data_fifo_0/s_axis_aclk] [get_bd_pins soft_reset/s_axis_aclk_300] \
  [get_bd_pins control_localstart/s_axis_aclk]
connect_bd_net -net MTS_Block_dac_clk [get_bd_pins s_axis_aclk1] \
  [get_bd_pins axis_data_fifo_2/s_axis_aclk] [get_bd_pins adc_strm_mux_0/s_axis_aclk] \
  [get_bd_pins axis_data_fifo_1/s_axis_aclk] [get_bd_pins axis_data_fifo_0/m_axis_aclk] \
  [get_bd_pins axis_register_slice_0/aclk] [get_bd_pins soft_reset/dac_clk] [get_bd_pins axis_broadcaster_0/aclk] \
  [get_bd_pins idle_packet_0/aclk]
connect_bd_net -net Din_0_1 [get_bd_pins Din_0] [get_bd_pins soft_reset/Din_0] [get_bd_pins loopback_gpio/Din] [get_bd_pins control_localstart/Din_0]
connect_bd_net [get_bd_pins axi_resetn] [get_bd_pins soft_reset/axi_resetn]
connect_bd_net [get_bd_pins dac_clk_aresetn] [get_bd_pins soft_reset/dac_clk_aresetn]
connect_bd_net -net xlslice_0_Dout [get_bd_pins loopback_gpio/Dout] [get_bd_pins adc_strm_mux_0/mux_select]
connect_bd_net [get_bd_pins soft_reset/dac_clk_soft_aresetn] \
  [get_bd_pins axis_data_fifo_1/s_axis_aresetn] [get_bd_pins axis_register_slice_0/aresetn] \
  [get_bd_pins axis_data_fifo_2/s_axis_aresetn] [get_bd_pins axis_broadcaster_0/aresetn] [get_bd_pins idle_packet_0/aresetn]
connect_bd_net [get_bd_pins soft_reset/axi_soft_resetn] [get_bd_pins axis_data_fifo_0/s_axis_aresetn]
connect_bd_net [get_bd_pins control_switch1/tready_o] [get_bd_pins axis_data_fifo_2/m_axis_tready]
connect_bd_net [get_bd_pins axis_broadcaster_0/s_axis_tready] [get_bd_pins control_switch1/tready_i]
connect_bd_net [get_bd_pins axis_data_fifo_2/m_axis_tvalid] [get_bd_pins control_switch1/tvalid_i]
connect_bd_net [get_bd_pins control_switch1/tvalid_o] [get_bd_pins axis_broadcaster_0/s_axis_tvalid]
connect_bd_net [get_bd_pins dac_control] [get_bd_pins control_switch1/dac_control]
connect_bd_net -net util_vector_logic_1_Res [get_bd_pins control_localstart/s_axis_tvalid_o] [get_bd_pins axis_data_fifo_0/s_axis_tvalid]
connect_bd_net [get_bd_pins s_axis_tvalid_i] [get_bd_pins control_localstart/s_axis_tvalid_i]
connect_bd_net -net pl_clk0_1 [get_bd_pins pl_clk0] [get_bd_pins idle_packet_0/s00_axi_aclk]
connect_bd_net [get_bd_pins peripheral_aresetn] [get_bd_pins idle_packet_0/s00_axi_aresetn]

current_bd_instance /dac_block3_tile0/soft_reset
connect_bd_net [get_bd_pins xlslice_0/Dout] [get_bd_pins util_vector_logic_2/Op1]
connect_bd_net [get_bd_pins util_vector_logic_2/Res] [get_bd_pins sync_1/src_in] [get_bd_pins sync_0/src_in]
connect_bd_net [get_bd_pins xlconstant_0/dout] [get_bd_pins sync_1/src_clk] [get_bd_pins sync_0/src_clk]
connect_bd_net -net Din_1_1 [get_bd_pins Din_0] [get_bd_pins xlslice_0/Din]
connect_bd_net -net dest_clk_0_1 [get_bd_pins dac_clk] [get_bd_pins sync_0/dest_clk]
connect_bd_net -net dest_clk_1_1 [get_bd_pins s_axis_aclk_300] [get_bd_pins sync_1/dest_clk]
connect_bd_net [get_bd_pins sync_0/dest_out] [get_bd_pins util_vector_logic_0/Op2]
connect_bd_net [get_bd_pins dac_clk_aresetn] [get_bd_pins util_vector_logic_0/Op1]
connect_bd_net [get_bd_pins axi_resetn] [get_bd_pins util_vector_logic_1/Op2]
connect_bd_net [get_bd_pins sync_1/dest_out] [get_bd_pins util_vector_logic_1/Op1]
connect_bd_net [get_bd_pins util_vector_logic_0/Res] [get_bd_pins dac_clk_soft_aresetn]
connect_bd_net [get_bd_pins util_vector_logic_1/Res] [get_bd_pins axi_soft_resetn]

current_bd_instance /dac_block3_tile0/control_switch1
connect_bd_net -net Op1_0_1 [get_bd_pins tready_i] [get_bd_pins util_vector_logic_0/Op1]
connect_bd_net -net Op1_1_1 [get_bd_pins tvalid_i] [get_bd_pins util_vector_logic_1/Op1]
connect_bd_net [get_bd_pins util_vector_logic_0/Res] [get_bd_pins tready_o]
connect_bd_net [get_bd_pins util_vector_logic_1/Res] [get_bd_pins tvalid_o]
connect_bd_net -net util_vector_logic_2_Res [get_bd_pins dac_control] [get_bd_pins util_vector_logic_0/Op2] [get_bd_pins util_vector_logic_1/Op2]

current_bd_instance /dac_block3_tile0/control_localstart
connect_bd_net [get_bd_pins s_axis_tvalid_i] [get_bd_pins util_vector_logic_1/Op1]
connect_bd_net [get_bd_pins util_vector_logic_1/Res] [get_bd_pins s_axis_tvalid_o]
connect_bd_net -net Din_0_1 [get_bd_pins Din_0] [get_bd_pins localstart_gpio/Din]
connect_bd_net [get_bd_pins localstart_gpio/Dout] [get_bd_pins sync_0/src_in]
connect_bd_net [get_bd_pins xlconstant_0/dout] [get_bd_pins sync_0/src_clk]
connect_bd_net [get_bd_pins sync_0/dest_out] [get_bd_pins util_vector_logic_1/Op2]
connect_bd_net [get_bd_pins s_axis_aclk] [get_bd_pins sync_0/dest_clk]

current_bd_instance /dac_block1_tile0
connect_bd_intf_net [get_bd_intf_pins S00_AXI] [get_bd_intf_pins idle_packet_0/S00_AXI]
connect_bd_intf_net [get_bd_intf_pins axis_data_fifo_0/M_AXIS] [get_bd_intf_pins adc_strm_mux_0/s0_axi_stream]
connect_bd_intf_net [get_bd_intf_pins axis_data_fifo_1/S_AXIS] [get_bd_intf_pins axis_broadcaster_0/M01_AXIS]
connect_bd_intf_net [get_bd_intf_pins idle_packet_0/S00_AXIS] [get_bd_intf_pins axis_broadcaster_0/M00_AXIS]
connect_bd_intf_net [get_bd_intf_pins axis_data_fifo_2/M_AXIS] [get_bd_intf_pins axis_broadcaster_0/S_AXIS]
connect_bd_intf_net [get_bd_intf_pins axis_data_fifo_1/M_AXIS] [get_bd_intf_pins adc_strm_mux_0/s1_axi_stream]
connect_bd_intf_net [get_bd_intf_pins adc_strm_mux_0/m0_axi_stream] [get_bd_intf_pins axis_register_slice_0/S_AXIS]
connect_bd_intf_net [get_bd_intf_pins SLOT_0_AXIS] [get_bd_intf_pins idle_packet_0/M00_AXIS]
connect_bd_intf_net [get_bd_intf_pins axis_register_slice_0/M_AXIS] [get_bd_intf_pins axis_data_fifo_2/S_AXIS]
connect_bd_intf_net [get_bd_intf_pins S_AXIS] [get_bd_intf_pins axis_data_fifo_0/S_AXIS]
connect_bd_net -net ddr4_0_c0_ddr4_ui_clk [get_bd_pins s_axis_aclk] \
  [get_bd_pins axis_data_fifo_0/s_axis_aclk] [get_bd_pins soft_reset/s_axis_aclk_300] \
  [get_bd_pins control_localstart/s_axis_aclk]
connect_bd_net -net MTS_Block_dac_clk [get_bd_pins s_axis_aclk1] \
  [get_bd_pins axis_data_fifo_2/s_axis_aclk] [get_bd_pins adc_strm_mux_0/s_axis_aclk] \
  [get_bd_pins axis_data_fifo_1/s_axis_aclk] [get_bd_pins axis_data_fifo_0/m_axis_aclk] \
  [get_bd_pins axis_register_slice_0/aclk] [get_bd_pins soft_reset/dac_clk] [get_bd_pins axis_broadcaster_0/aclk] \
  [get_bd_pins idle_packet_0/aclk]
connect_bd_net -net control_block_dest_out_0 [get_bd_pins dac_control] [get_bd_pins control_switch/dac_control]
connect_bd_net -net Din_0_1 [get_bd_pins Din_0] [get_bd_pins soft_reset/Din_0] [get_bd_pins xlslice_0/Din] [get_bd_pins control_localstart/Din_0]
connect_bd_net [get_bd_pins axi_resetn] [get_bd_pins soft_reset/axi_resetn]
connect_bd_net [get_bd_pins dac_clk_aresetn] [get_bd_pins soft_reset/dac_clk_aresetn]
connect_bd_net [get_bd_pins xlslice_0/Dout] [get_bd_pins adc_strm_mux_0/mux_select]
connect_bd_net [get_bd_pins soft_reset/dac_clk_soft_aresetn] \
  [get_bd_pins axis_data_fifo_1/s_axis_aresetn] [get_bd_pins axis_register_slice_0/aresetn] \
  [get_bd_pins axis_data_fifo_2/s_axis_aresetn] [get_bd_pins axis_broadcaster_0/aresetn] [get_bd_pins idle_packet_0/aresetn]
connect_bd_net [get_bd_pins soft_reset/axi_soft_resetn] [get_bd_pins axis_data_fifo_0/s_axis_aresetn]
connect_bd_net [get_bd_pins axis_broadcaster_0/s_axis_tready] [get_bd_pins control_switch/tready_i]
connect_bd_net [get_bd_pins control_switch/tready_o] [get_bd_pins axis_data_fifo_2/m_axis_tready]
connect_bd_net -net tvalid_i_1 [get_bd_pins axis_data_fifo_2/m_axis_tvalid] [get_bd_pins control_switch/tvalid_i]
connect_bd_net [get_bd_pins control_switch/tvalid_o] [get_bd_pins axis_broadcaster_0/s_axis_tvalid]
connect_bd_net [get_bd_pins control_localstart/s_axis_tvalid_o] [get_bd_pins axis_data_fifo_0/s_axis_tvalid]
connect_bd_net [get_bd_pins s_axis_tvalid_i] [get_bd_pins control_localstart/s_axis_tvalid_i]
connect_bd_net -net pl_clk0_1 [get_bd_pins pl_clk0] [get_bd_pins idle_packet_0/s00_axi_aclk]
connect_bd_net [get_bd_pins peripheral_aresetn] [get_bd_pins idle_packet_0/s00_axi_aresetn]

current_bd_instance /dac_block1_tile0/control_switch
connect_bd_net -net Op1_0_1 [get_bd_pins tready_i] [get_bd_pins util_vector_logic_0/Op1]
connect_bd_net -net Op1_1_1 [get_bd_pins tvalid_i] [get_bd_pins util_vector_logic_1/Op1]
connect_bd_net [get_bd_pins util_vector_logic_0/Res] [get_bd_pins tready_o]
connect_bd_net [get_bd_pins util_vector_logic_1/Res] [get_bd_pins tvalid_o]
connect_bd_net -net sync_0_dest_out [get_bd_pins dac_control] [get_bd_pins util_vector_logic_0/Op2] [get_bd_pins util_vector_logic_1/Op2]

current_bd_instance /dac_block1_tile0/soft_reset
connect_bd_net [get_bd_pins xlslice_0/Dout] [get_bd_pins util_vector_logic_2/Op1]
connect_bd_net [get_bd_pins util_vector_logic_2/Res] [get_bd_pins sync_1/src_in] [get_bd_pins sync_0/src_in]
connect_bd_net [get_bd_pins xlconstant_0/dout] [get_bd_pins sync_1/src_clk] [get_bd_pins sync_0/src_clk]
connect_bd_net -net Din_1_1 [get_bd_pins Din_0] [get_bd_pins xlslice_0/Din]
connect_bd_net -net dest_clk_0_1 [get_bd_pins dac_clk] [get_bd_pins sync_0/dest_clk]
connect_bd_net -net dest_clk_1_1 [get_bd_pins s_axis_aclk_300] [get_bd_pins sync_1/dest_clk]
connect_bd_net [get_bd_pins sync_0/dest_out] [get_bd_pins util_vector_logic_0/Op2]
connect_bd_net [get_bd_pins dac_clk_aresetn] [get_bd_pins util_vector_logic_0/Op1]
connect_bd_net [get_bd_pins axi_resetn] [get_bd_pins util_vector_logic_1/Op2]
connect_bd_net [get_bd_pins sync_1/dest_out] [get_bd_pins util_vector_logic_1/Op1]
connect_bd_net [get_bd_pins util_vector_logic_0/Res] [get_bd_pins dac_clk_soft_aresetn]
connect_bd_net [get_bd_pins util_vector_logic_1/Res] [get_bd_pins axi_soft_resetn]

current_bd_instance /dac_block1_tile0/control_localstart
connect_bd_net [get_bd_pins s_axis_tvalid_i] [get_bd_pins util_vector_logic_1/Op1]
connect_bd_net [get_bd_pins util_vector_logic_1/Res] [get_bd_pins s_axis_tvalid_o]
connect_bd_net -net Din_0_1 [get_bd_pins Din_0] [get_bd_pins localstart_gpio/Din]
connect_bd_net [get_bd_pins localstart_gpio/Dout] [get_bd_pins sync_0/src_in]
connect_bd_net [get_bd_pins sync_0/dest_out] [get_bd_pins util_vector_logic_1/Op2]
connect_bd_net [get_bd_pins xlconstant_0/dout] [get_bd_pins sync_0/src_clk]
connect_bd_net [get_bd_pins s_axis_aclk] [get_bd_pins sync_0/dest_clk]
